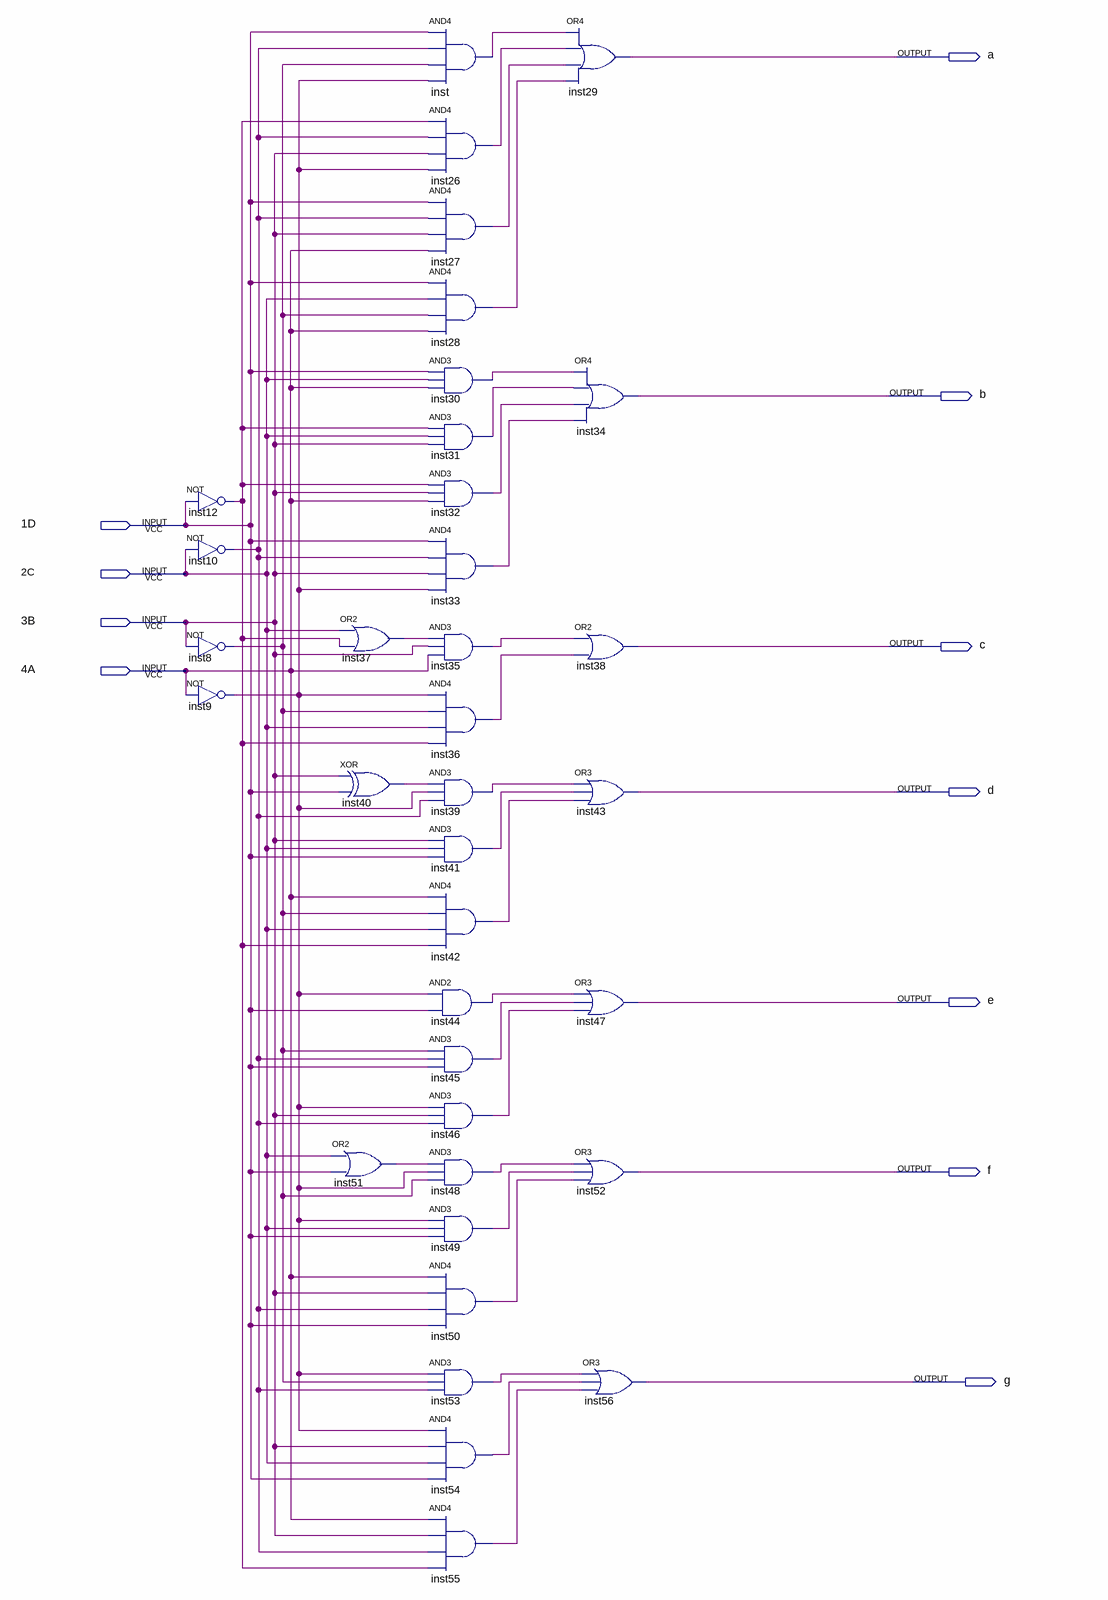
[diagram p0: schematic sheet]
// Quartus schematic display.bdf as structural Verilog: 36 symbols, 11 pins
module display (
  input  \1D ,
  input  \2C ,
  input  \3B ,
  input  \4A ,
  output a,
  output b,
  output c,
  output d,
  output e,
  output f,
  output g
);

  wire inst8_out, inst9_out, inst10_out, inst12_out, inst26_out, inst27_out, inst28_out, inst30_out,
       inst31_out, inst32_out, inst33_out, inst35_out, inst36_out, inst37_out, inst39_out, inst40_out,
       inst41_out, inst42_out, inst44_out, inst45_out, inst46_out, inst48_out, inst49_out, inst50_out,
       inst51_out, inst53_out, inst54_out, inst55_out, inst_out;

  not inst12 (inst12_out, \1D );
  not inst10 (inst10_out, \2C );
  not inst8 (inst8_out, \3B );
  not inst9 (inst9_out, \4A );
  or inst37 (inst37_out, \2C , inst12_out);
  xor inst40 (inst40_out, \3B , \1D );
  or inst51 (inst51_out, \2C , \1D );
  and inst (inst_out, \1D , inst10_out, inst8_out, inst9_out);
  and inst26 (inst26_out, inst12_out, inst10_out, \3B , inst9_out);
  and inst27 (inst27_out, \1D , inst10_out, \3B , \4A );
  and inst28 (inst28_out, \1D , \2C , inst8_out, \4A );
  and inst30 (inst30_out, \1D , \2C , \4A );
  and inst31 (inst31_out, inst12_out, \2C , \3B );
  and inst32 (inst32_out, inst12_out, \3B , \4A );
  and inst33 (inst33_out, \1D , inst10_out, \3B , inst9_out);
  and inst35 (inst35_out, inst37_out, \3B , \4A );
  and inst36 (inst36_out, inst9_out, inst8_out, \2C , inst12_out);
  and inst39 (inst39_out, inst40_out, inst9_out, inst10_out);
  and inst41 (inst41_out, \3B , \2C , \1D );
  and inst42 (inst42_out, \4A , inst8_out, \2C , inst12_out);
  and inst44 (inst44_out, inst9_out, \1D );
  and inst45 (inst45_out, inst8_out, inst10_out, \1D );
  and inst46 (inst46_out, inst9_out, \3B , inst10_out);
  and inst48 (inst48_out, inst51_out, inst9_out, inst8_out);
  and inst49 (inst49_out, inst9_out, \2C , \1D );
  and inst50 (inst50_out, \4A , \3B , inst10_out, \1D );
  and inst53 (inst53_out, inst9_out, inst8_out, inst10_out);
  and inst54 (inst54_out, inst9_out, \3B , \2C , \1D );
  and inst55 (inst55_out, \4A , \3B , inst10_out, inst12_out);
  or inst29 (a, inst_out, inst26_out, inst27_out, inst28_out);
  or inst34 (b, inst30_out, inst31_out, inst32_out, inst33_out);
  or inst38 (c, inst35_out, inst36_out);
  or inst43 (d, inst39_out, inst41_out, inst42_out);
  or inst47 (e, inst44_out, inst45_out, inst46_out);
  or inst52 (f, inst48_out, inst49_out, inst50_out);
  or inst56 (g, inst53_out, inst54_out, inst55_out);
endmodule
